# EAGLE design MD2019-hole (EAGLE 9.3.1)

## Sheet 1 of 4: Driver Part
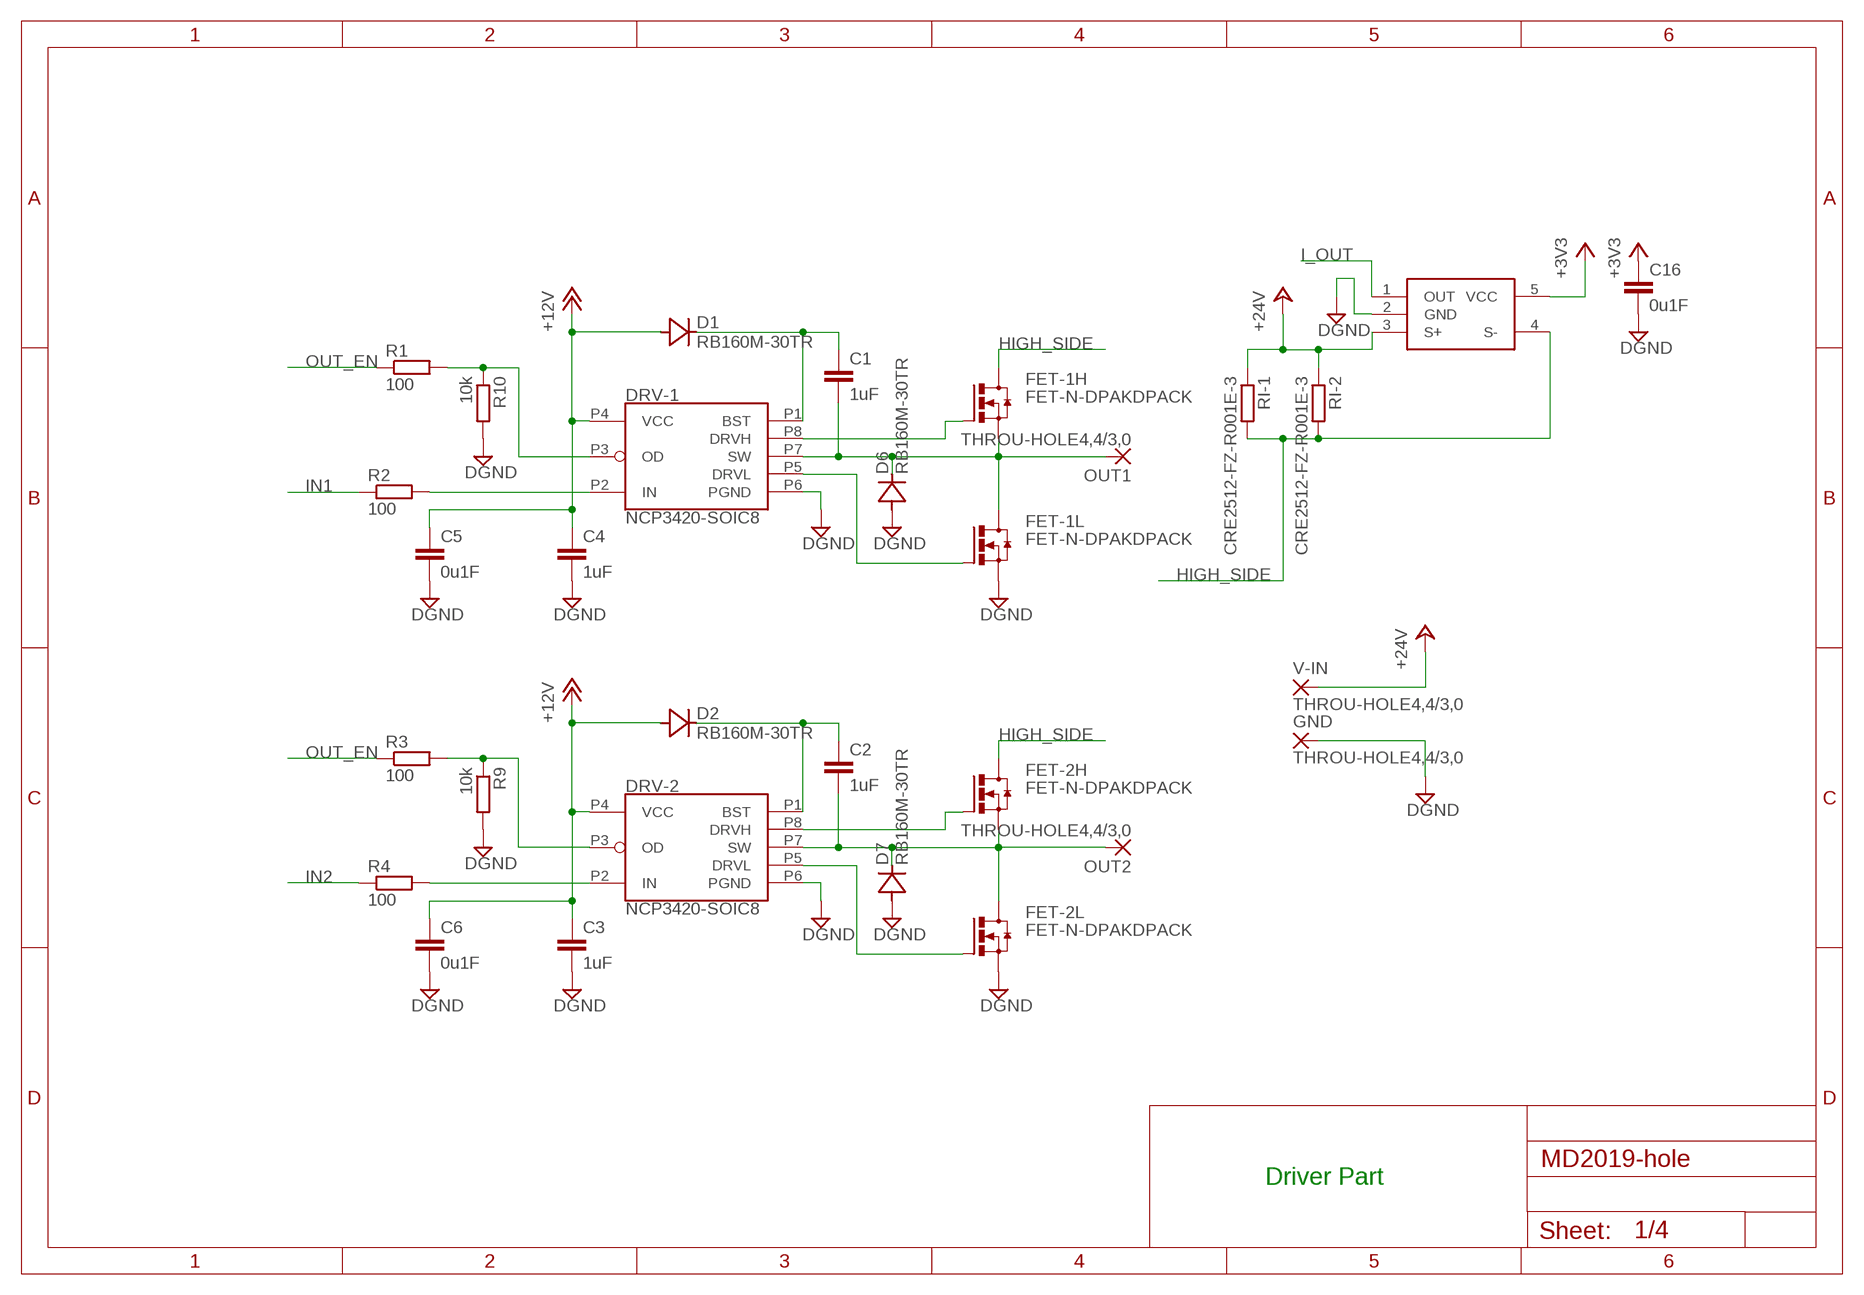
[diagram p0: schematic, sheet 1]

### Parts
C1  1uF  C-EUC0805  [C0805]
C2  1uF  C-EUC0805  [C0805]
C3  1uF  C-EUC0805  [C0805]
C4  1uF  C-EUC0805  [C0805]
C5  0u1F  C-EUC0805  [C0805]
C6  0u1F  C-EUC0805  [C0805]
C16  0u1F  C-EUC0805  [C0805]
D1  RB160M-30TR  DIODE-  [SOD123]
D2  RB160M-30TR  DIODE-  [SOD123]
D6  RB160M-30TR  DIODE-  [SOD123]
D7  RB160M-30TR  DIODE-  [SOD123]
DRV-1  NCP3420-SOIC8  [SOIC-8]
DRV-2  NCP3420-SOIC8  [SOIC-8]
FET-1H  FET-N-DPAKDPACK  [DPACK]
FET-1L  FET-N-DPAKDPACK  [DPACK]
FET-2H  FET-N-DPAKDPACK  [DPACK]
FET-2L  FET-N-DPAKDPACK  [DPACK]
GND  THROU-HOLE4,4/3,0  [4,4/3,0]
I_SEN  ZXCT108  [SOT25]
OUT1  THROU-HOLE4,4/3,0  [4,4/3,0]
OUT2  THROU-HOLE4,4/3,0  [4,4/3,0]
R1  100  R-EU_R0603  [R0603]
R2  100  R-EU_R0603  [R0603]
R3  100  R-EU_R0603  [R0603]
R4  100  R-EU_R0603  [R0603]
R9  10k  R-EU_R0603  [R0603]
R10  10k  R-EU_R0603  [R0603]
RI-1  CRE2512-FZ-R001E-3  [CRE2512-R001]
RI-2  CRE2512-FZ-R001E-3  [CRE2512-R001]
V-IN  THROU-HOLE4,4/3,0  [4,4/3,0]

### Nets
+3V3: C16.1 I_SEN.5(VCC) ; also sheet 2,3,4
+12V: C3.1 C4.1 C5.1 C6.1 D1.A D2.A DRV-1.P4(VCC) DRV-2.P4(VCC) ; also sheet 4
+24V: I_SEN.3(S+) RI-1.P$1 RI-2.P$1 V-IN.1(P) ; also sheet 4
DGND: C3.2 C4.2 C5.2 C6.2 C16.2 D6.A D7.A DRV-1.P6(PGND) DRV-2.P6(PGND) FET-1L.3(S) FET-2L.3(S) GND.1(P) I_SEN.2(GND) R9.2 R10.2 ; also sheet 2,3,4
HIGH_SIDE: FET-1H.4(D) FET-2H.4(D) I_SEN.4(S-) RI-1.P$2 RI-2.P$2
I_OUT: I_SEN.1(OUT) ; also sheet 2
IN1: R2.1 ; also sheet 2
IN2: R4.1 ; also sheet 2
N$1: C1.2 D6.C DRV-1.P7(SW) FET-1H.3(S) FET-1L.4(D) OUT1.1(P)
N$2: C1.1 D1.C DRV-1.P1(BST)
N$3: DRV-1.P8(DRVH) FET-1H.1(G)
N$4: DRV-1.P5(DRVL) FET-1L.1(G)
N$5: C2.2 D7.C DRV-2.P7(SW) FET-2H.3(S) FET-2L.4(D) OUT2.1(P)
N$6: C2.1 D2.C DRV-2.P1(BST)
N$7: DRV-2.P2(IN) R4.2
N$8: DRV-2.P8(DRVH) FET-2H.1(G)
N$9: DRV-2.P5(DRVL) FET-2L.1(G)
N$10: DRV-2.P3(OD) R3.2 R9.1
N$11: DRV-1.P2(IN) R2.2
N$12: DRV-1.P3(OD) R1.2 R10.1
OUT_EN: R1.1 R3.1 ; also sheet 2

### Notes on the sheet
- Driver Part

## Sheet 2 of 4: STM32
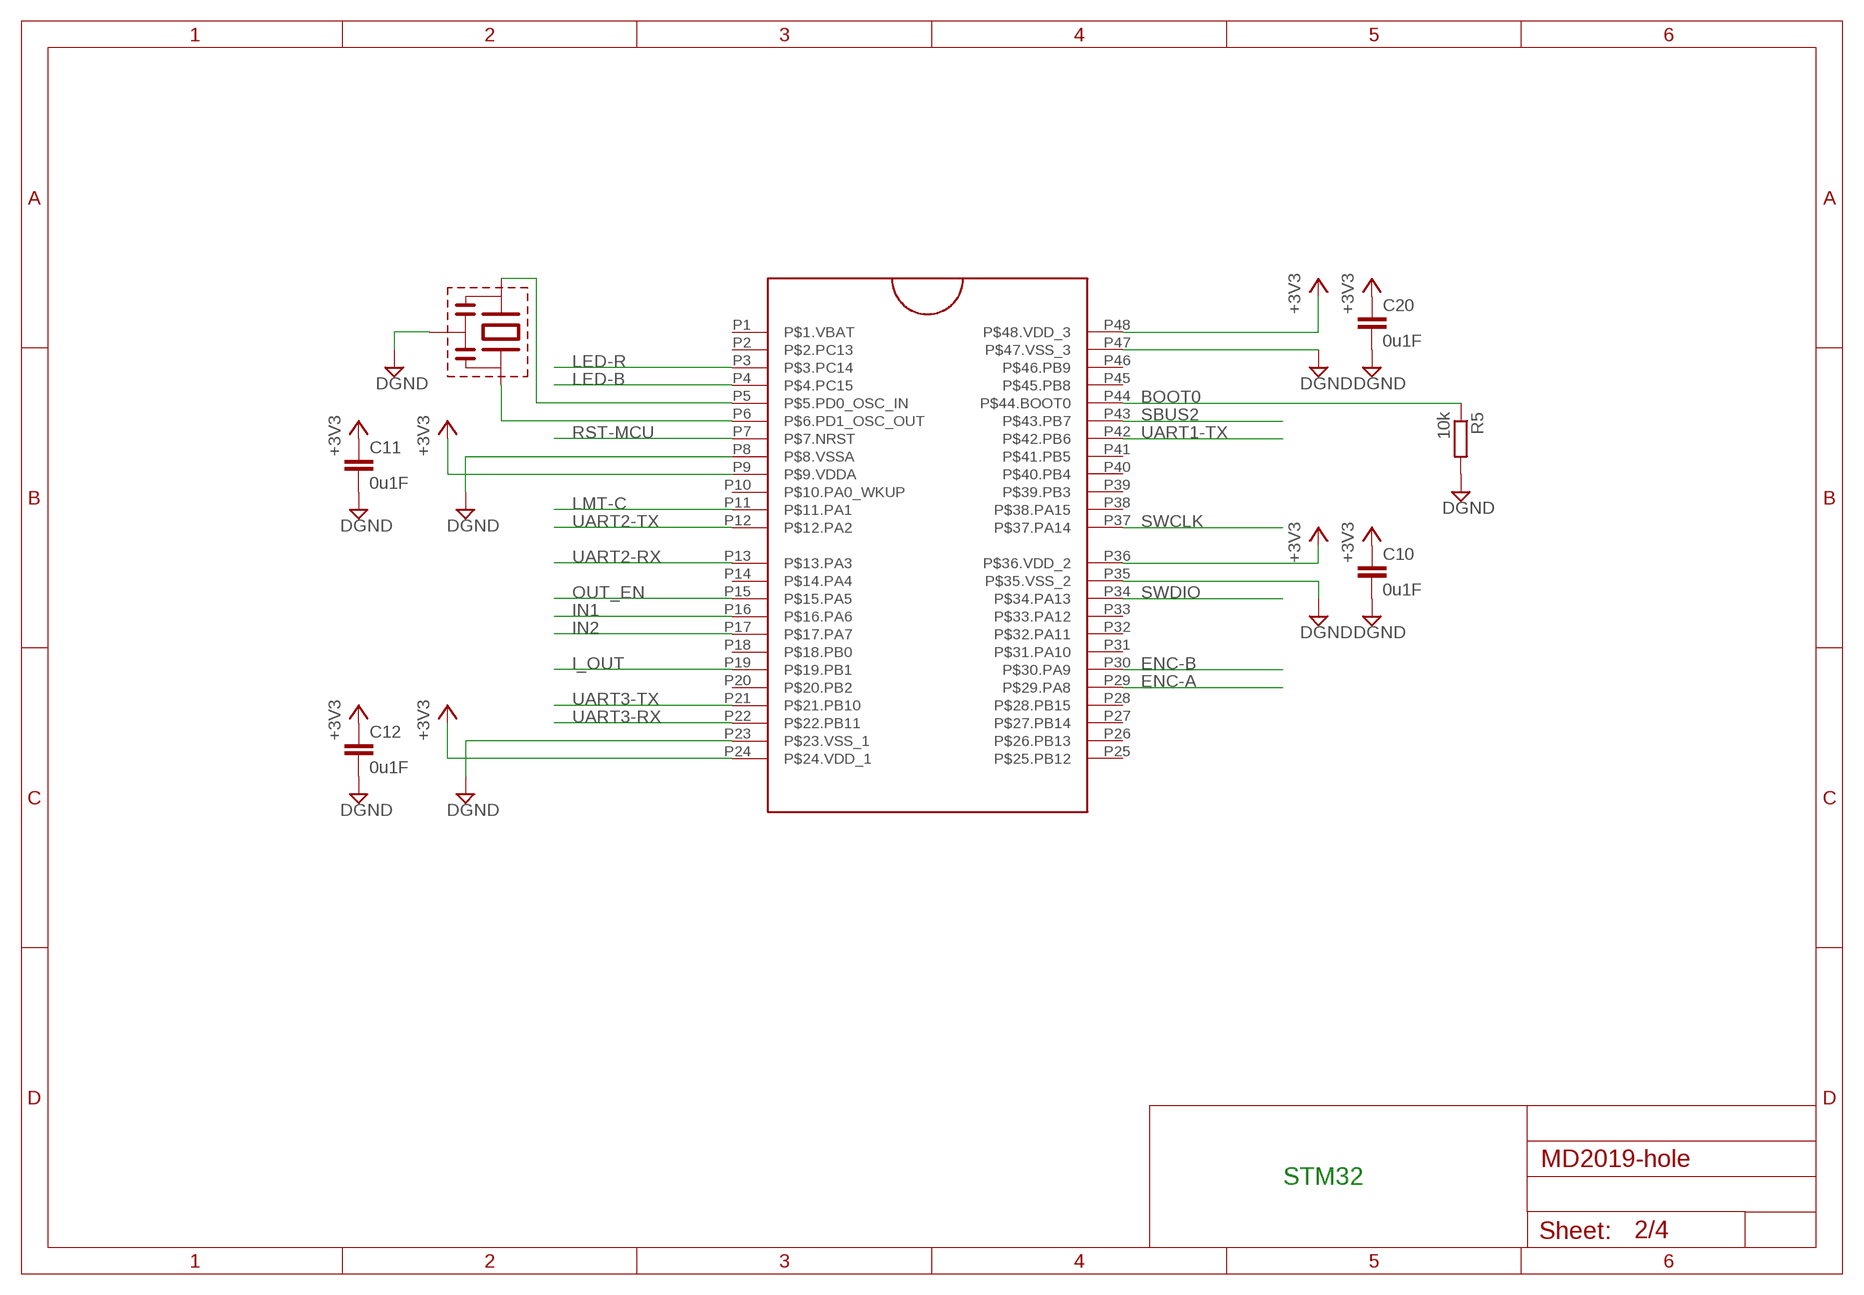
[diagram p1: schematic, sheet 2]

### Parts
C10  0u1F  C-EUC0805  [C0805]
C11  0u1F  C-EUC0805  [C0805]
C12  0u1F  C-EUC0805  [C0805]
C20  0u1F  C-EUC0805  [C0805]
OSC  CERALOCK  [CSTCE]
R5  10k  R-EU_R0603  [R0603]
U$11  STM32F1038  [LQFP48_F103]

### Nets
+3V3: C10.1 C11.1 C12.1 C20.1 U$11.P9(P$9.VDDA) U$11.P24(P$24.VDD_1) U$11.P36(P$36.VDD_2) U$11.P48(P$48.VDD_3) ; also sheet 1,3,4
BOOT0: R5.1 U$11.P44(P$44.BOOT0)
DGND: C10.2 C11.2 C12.2 C20.2 OSC.P$3 R5.2 U$11.P8(P$8.VSSA) U$11.P23(P$23.VSS_1) U$11.P35(P$35.VSS_2) U$11.P47(P$47.VSS_3) ; also sheet 1,3,4
ENC-A: U$11.P29(P$29.PA8) ; also sheet 3
ENC-B: U$11.P30(P$30.PA9) ; also sheet 3
I_OUT: U$11.P19(P$19.PB1) ; also sheet 1
IN1: U$11.P16(P$16.PA6) ; also sheet 1
IN2: U$11.P17(P$17.PA7) ; also sheet 1
LED-B: U$11.P4(P$4.PC15) ; also sheet 3
LED-R: U$11.P3(P$3.PC14) ; also sheet 3
LMT-C: U$11.P11(P$11.PA1) ; also sheet 3
N$19: OSC.P$1 U$11.P5(P$5.PD0_OSC_IN)
N$20: OSC.P$2 U$11.P6(P$6.PD1_OSC_OUT)
OUT_EN: U$11.P15(P$15.PA5) ; also sheet 1
RST-MCU: U$11.P7(P$7.NRST) ; also sheet 3
SBUS2: U$11.P43(P$43.PB7) ; also sheet 3
SWCLK: U$11.P37(P$37.PA14) ; also sheet 3
SWDIO: U$11.P34(P$34.PA13) ; also sheet 3
UART1-TX: U$11.P42(P$42.PB6)
UART2-RX: U$11.P13(P$13.PA3) ; also sheet 3
UART2-TX: U$11.P12(P$12.PA2) ; also sheet 3
UART3-RX: U$11.P22(P$22.PB11) ; also sheet 3
UART3-TX: U$11.P21(P$21.PB10) ; also sheet 3
Unconnected: U$11.P1(P$1.VBAT) U$11.P2(P$2.PC13) U$11.P10(P$10.PA0_WKUP) U$11.P14(P$14.PA4) U$11.P18(P$18.PB0) U$11.P20(P$20.PB2) U$11.P25(P$25.PB12) U$11.P26(P$26.PB13) U$11.P27(P$27.PB14) U$11.P28(P$28.PB15) U$11.P31(P$31.PA10) U$11.P32(P$32.PA11) U$11.P33(P$33.PA12) U$11.P38(P$38.PA15) U$11.P39(P$39.PB3) U$11.P40(P$40.PB4) U$11.P41(P$41.PB5) U$11.P45(P$45.PB8) U$11.P46(P$46.PB9)

### Notes on the sheet
- STM32

## Sheet 3 of 4: Peripherarl / Interface
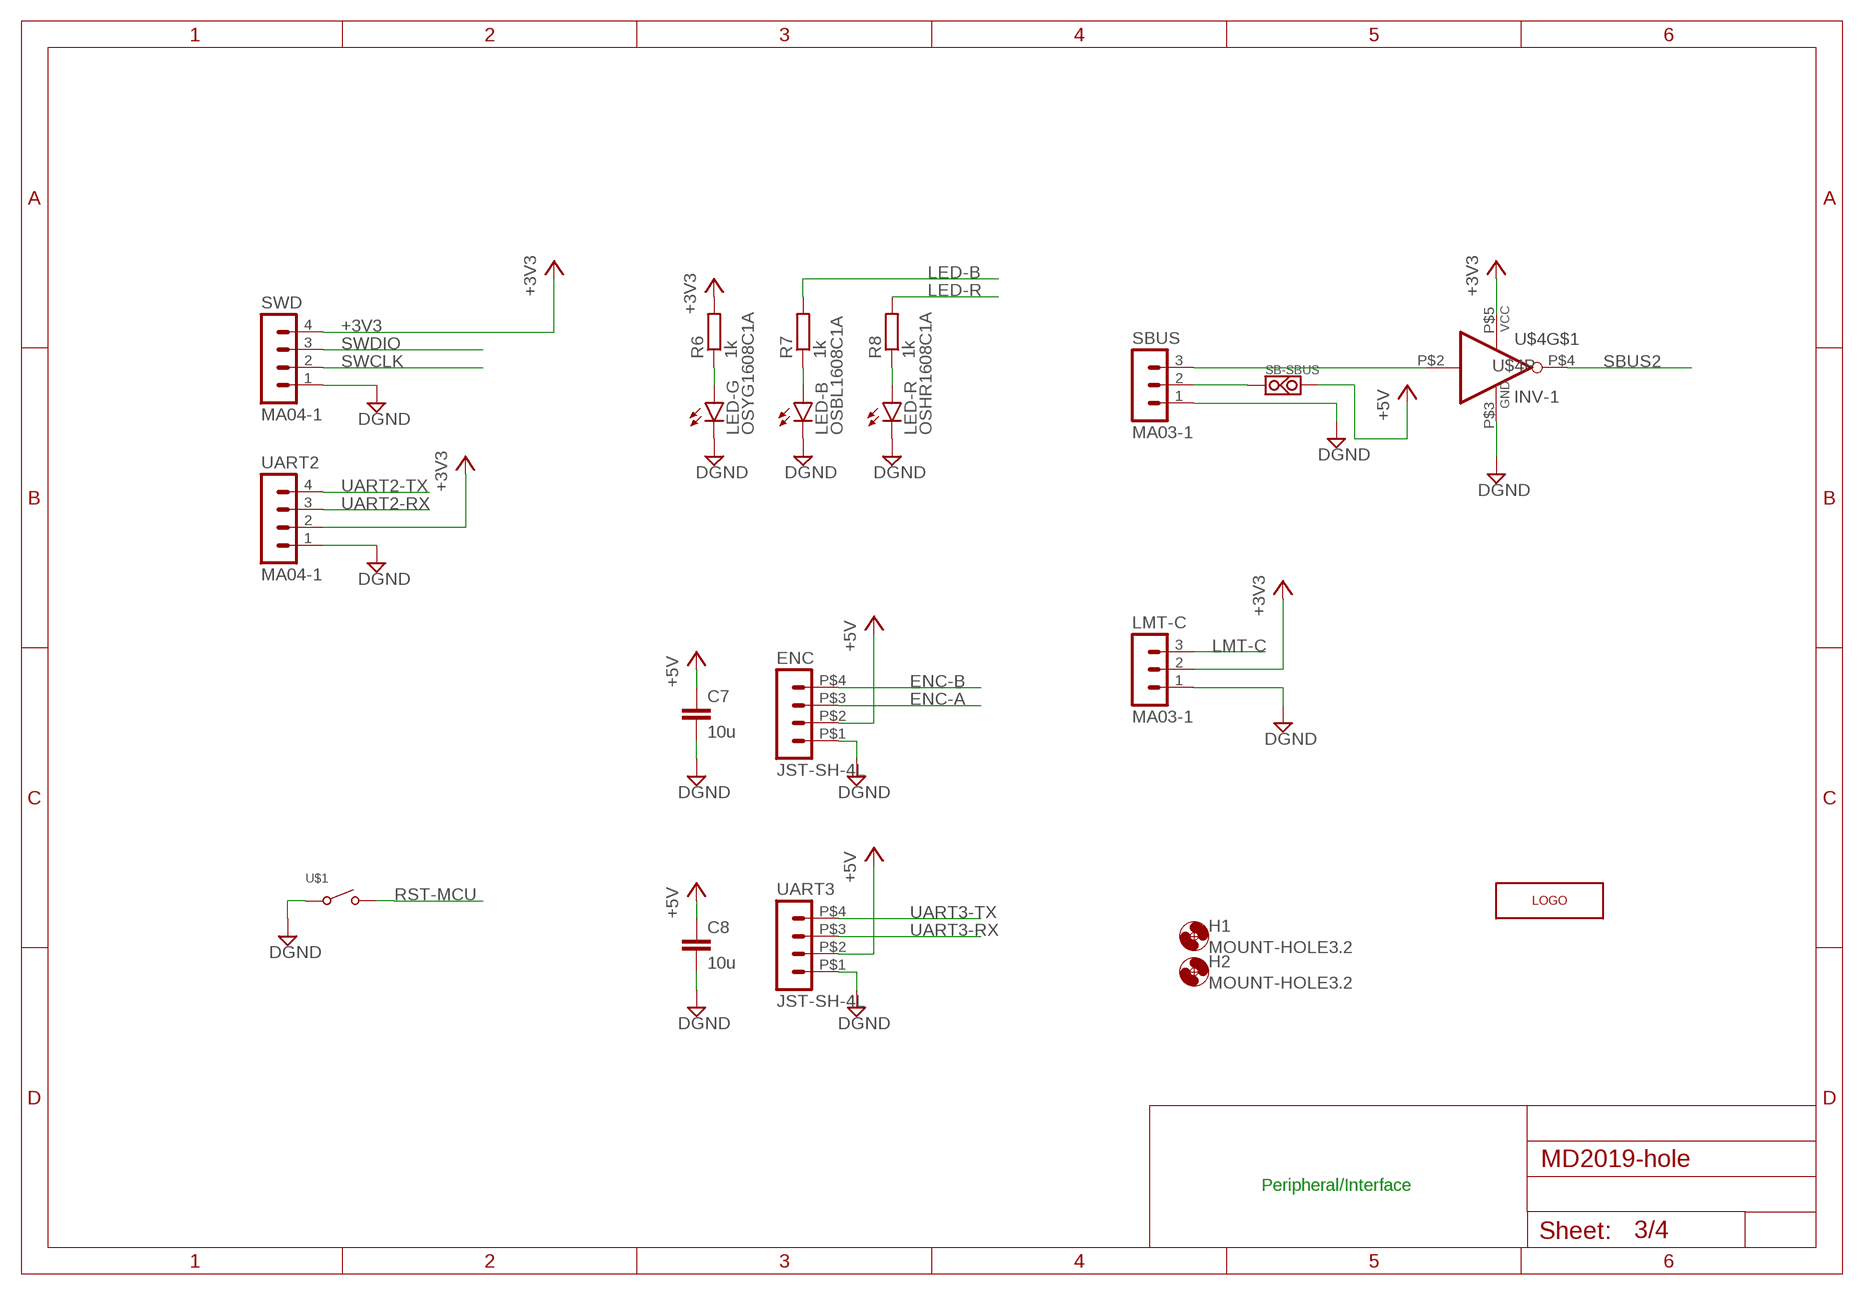
[diagram p2: schematic, sheet 3]

### Parts
C7  10u  C-EUC0805K  [C0805K]
C8  10u  C-EUC0805K  [C0805K]
ENC  JST-SH-4L  [JST-SH-4L]
H1  MOUNT-HOLE3.2  [3,2]
H2  MOUNT-HOLE3.2  [3,2]
LED-B  OSBL1608C1A  LEDCHIPLED_0603  [CHIPLED_0603]
LED-G  OSYG1608C1A  LEDCHIPLED_0603  [CHIPLED_0603]
LED-R  OSHR1608C1A  LEDCHIPLED_0603  [CHIPLED_0603]
LMT-C  MA03-1  [MA03-1]
R6  1k  R-EU_R0603  [R0603]
R7  1k  R-EU_R0603  [R0603]
R8  1k  R-EU_R0603  [R0603]
SB-SBUS  SHORT-PINLAND  [SHORT-LAND]
SBUS  MA03-1  [MA03-1]
SWD  MA04-1  [MA04-1]
U$1  TACTILE-SMALL  [TACTILE-SMALL]
U$3  LOGOKUTEI2  [LOGO_KUTEI2]
U$4  INV-1  [CMPAK-5]
UART2  MA04-1  [MA04-1]
UART3  JST-SH-4L  [JST-SH-4L]

### Nets
+3V3: LMT-C.2 R6.2 SWD.4 U$4.P$5(P:VCC) UART2.2 ; also sheet 1,2,4
+5V: C7.1 C8.1 ENC.P$2 SB-SBUS.FROM UART3.P$2 ; also sheet 4
DGND: C7.2 C8.2 ENC.P$1 LED-B.C LED-G.C LED-R.C LMT-C.1 SBUS.1 SWD.1 U$1.P$1 U$4.P$3(P:GND) UART2.1 UART3.P$1 ; also sheet 1,2,4
ENC-A: ENC.P$3 ; also sheet 2
ENC-B: ENC.P$4 ; also sheet 2
LED-B: R7.2 ; also sheet 2
LED-R: R8.2 ; also sheet 2
LMT-C: LMT-C.3 ; also sheet 2
N$14: SBUS.3 U$4.P$2(I)
N$15: SB-SBUS.TO SBUS.2
N$17: LED-R.A R8.1
N$23: LED-G.A R6.1
N$24: LED-B.A R7.1
RST-MCU: U$1.P$2 ; also sheet 2
SBUS2: U$4.P$4(O) ; also sheet 2
SWCLK: SWD.2 ; also sheet 2
SWDIO: SWD.3 ; also sheet 2
UART2-RX: UART2.3 ; also sheet 2
UART2-TX: UART2.4 ; also sheet 2
UART3-RX: UART3.P$3 ; also sheet 2
UART3-TX: UART3.P$4 ; also sheet 2

### Notes on the sheet
- Peripheral/Interface

## Sheet 4 of 4: Power Supplay
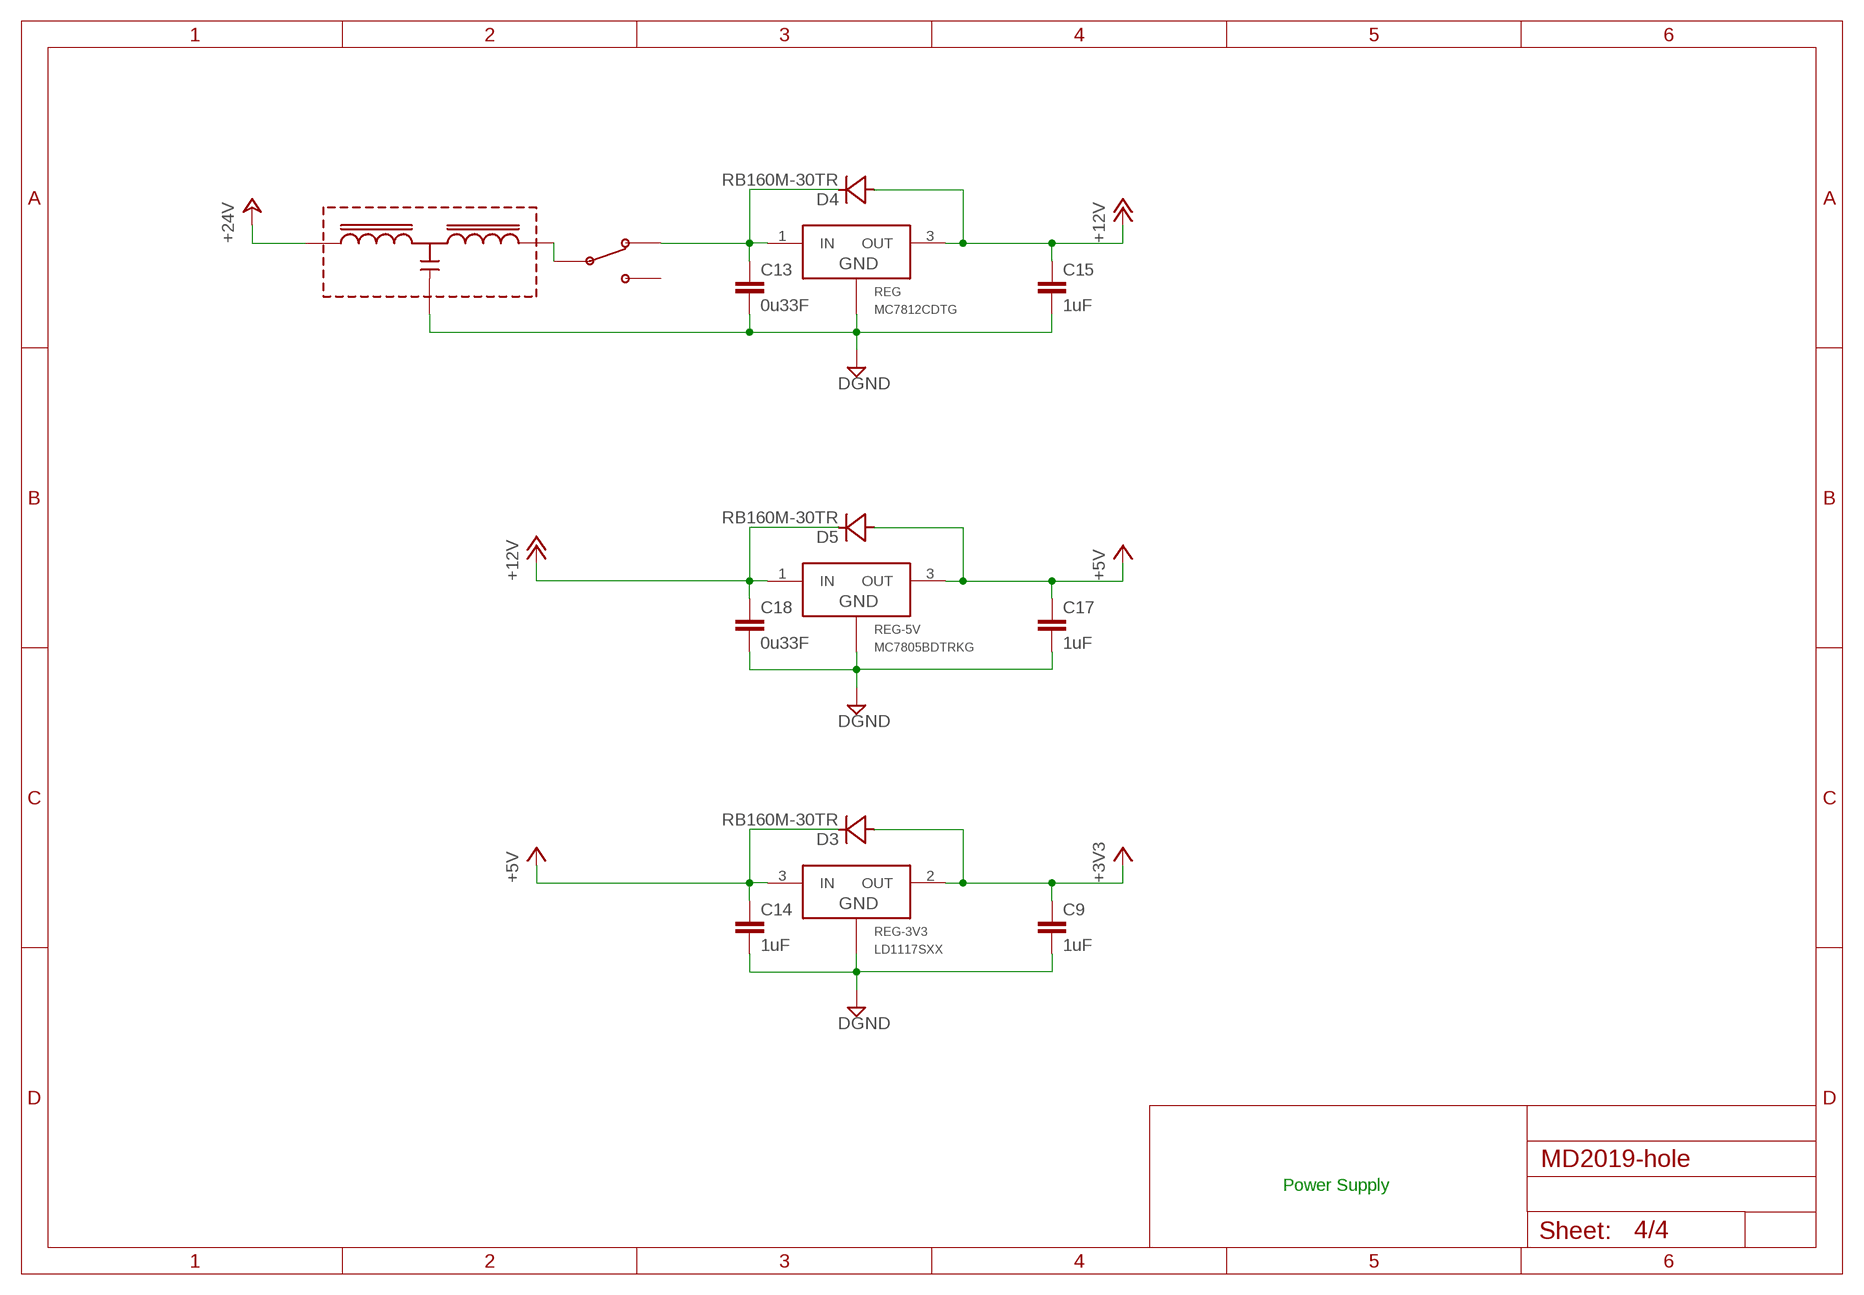
[diagram p3: schematic, sheet 4]

### Parts
C9  1uF  C-EUC0805  [C0805]
C13  0u33F  C-EUC0805  [C0805]
C14  1uF  C-EUC0805  [C0805]
C15  1uF  C-EUC0805  [C0805]
C17  1uF  C-EUC0805  [C0805]
C18  0u33F  C-EUC0805  [C0805]
D3  RB160M-30TR  DIODE-  [SOD123]
D4  RB160M-30TR  DIODE-  [SOD123]
D5  RB160M-30TR  DIODE-  [SOD123]
FLT1  EMI-ACHXX4518-L  [ACH4518-L]
PWR-SW  SW-SPDT  [SSSS213202]
REG  MC7812CDTG  78XXDPACK  [DPACK]
REG-3V3  LD1117SXX  [SOT223]
REG-5V  MC7805BDTRKG  78XXDPACK  [DPACK]

### Nets
+3V3: C9.1 D3.A REG-3V3.2(OUT) ; also sheet 1,2,3
+5V: C14.1 C17.1 D3.C D5.A REG-3V3.3(IN) REG-5V.3(OUT) ; also sheet 3
+12V: C15.1 C18.1 D4.A D5.C REG-5V.1(IN) REG.3(OUT) ; also sheet 1
+24V: FLT1.P$1 ; also sheet 1
DGND: C9.2 C13.2 C14.2 C15.2 C17.2 C18.2 FLT1.P$2 REG-3V3.1(GND) REG-3V3.4(GND) REG-5V.4(GND) REG.4(GND) ; also sheet 1,2,3
N$13: FLT1.P$3 PWR-SW.P$2 PWR-SW.P$5
N$18: C13.1 D4.C PWR-SW.P$3 PWR-SW.P$6 REG.1(IN)
Unconnected: PWR-SW.P$1 PWR-SW.P$4

### Notes on the sheet
- Power Supply

## Library data of the parts
C1-C18 C20 = rcl:C-EU: CAPACITOR, European symbol; SPICEPREFIX: C
D1-D7 = My-Library:DIODE-
DRV-1 DRV-2 = My-Library:NCP3420-SOIC8
ENC UART3 = My-con:JST-SH-4L
FET-1H FET-1L FET-2H FET-2L = My-Library:FET-N-DPAK
FLT1 = My-Library:EMI-ACHXX
GND OUT1 OUT2 V-IN = My-Library:THROU-HOLE
H1 H2 = holes:MOUNT-HOLE: MOUNTING HOLE with drill center marker
I_SEN = My-Library:ZXCT108*
LED-B LED-G LED-R = led:LED: LED OSRAM: - CHIPLED LG R971, LG N971, LY N971, LG Q971, LY Q971, LO R971, LY R971 LH N974, LH R974 LS Q976, LO Q976, LY Q976 LO Q996 - Hyper CHIPLED LW Q18S LB Q993, LB Q99A, LB R99A - SideLED LS A670, LO A670, LY A670, LG A670, LP A670 LB A673, LV A673, LT A673, LW A673 LH A674 LY A675 LS A676, LA A676, LO A676, LY A676, LW A676 LS A679, LY A679, LG A679 - Hyper Micro SIDELED® LS Y876, LA Y876, LO Y876, LY Y876 LT Y87S - SmartLED LW L88C, LW L88S LB L89C, LB L89S, LG L890 LS L89K, LO L89K, LY L89K LS L896, LA L896, LO L896, LY L896 - TOPLED LS T670, LO T670, LY T670, LG T670, LP T670 LSG T670, LSP T670, LSY T670, LOP T670, LYG T670 LG T671, LOG T671, LSG T671 LB T673, LV T673, LT T673, LW T673 LH T674 LS T676, LA T676, LO T676, LY T676, LB T676, LH T676, LSB T676, LW T676 LB T67C, LV T67C, LT T67C, LS T67K, LO T67K, LY T67K, LW E67C LS E67B, LA E67B, LO E67B, LY E67B, LB E67C, LV E67C, LT E67C LW T67C LS T679, LY T679, LG T679 LS T770, LO T770, LY T770, LG T770, LP T770 LB T773, LV T773, LT T773, LW T773 LH T774 LS E675, LA E675, LY E675, LS T675 LS T776, LA T776, LO T776, LY T776, LB T776 LHGB T686 LT T68C, LB T68C - Hyper Mini TOPLED® LB M676 - Mini TOPLED Santana® LG M470 LS M47K, LO M47K, LY M47K Source: http://www.osram.convergy.de LUXEON: - LUMILED® LXK2-PW12-R00, LXK2-PW12-S00, LXK2-PW14-U00, LXK2-PW14-V00 LXK2-PM12-R00, LXK2-PM12-S00, LXK2-PM14-U00 LXK2-PE12-Q00, LXK2-PE12-R00, LXK2-PE12-S00, LXK2-PE14-T00, LXK2-PE14-U00 LXK2-PB12-K00, LXK2-PB12-L00, LXK2-PB12-M00, LXK2-PB14-N00, LXK2-PB14-P00, LXK2-PB14-Q00 LXK2-PR12-L00, LXK2-PR12-M00, LXK2-PR14-Q00, LXK2-PR14-R00 LXK2-PD12-Q00, LXK2-PD12-R00, LXK2-PD12-S00 LXK2-PH12-R00, LXK2-PH12-S00 LXK2-PL12-P00, LXK2-PL12-Q00, LXK2-PL12-R00 Source: www.luxeon.com KINGBRIGHT: KA-3528ASYC Source: www.kingbright.com
LMT-C SBUS = My-Library:MA03-1
OSC = My-Library:CERALOCK
PWR-SW = My-Library:SW-SPDT
R1-R4 R9 R10 = rcl:R-EU_: RESISTOR, European symbol; SPICEPREFIX: R
R5-R8 = rcl:R-EU_: RESISTOR, European symbol
REG REG-5V = My-Library:78XX
REG-3V3 = My-Library:LD1117SXX
RI-1 RI-2 = My-Library:CRE2512-FZ-R001E-3
SB-SBUS = My-Library:SHORT-PIN
SWD UART2 = My-Library:MA04-1
U$1 = My-Library:TACTILE-SMALL
U$3 = My-Library:LOGO
U$4 = My-Library:INV-1
U$11 = My-Library:STM32F103*8

## Board
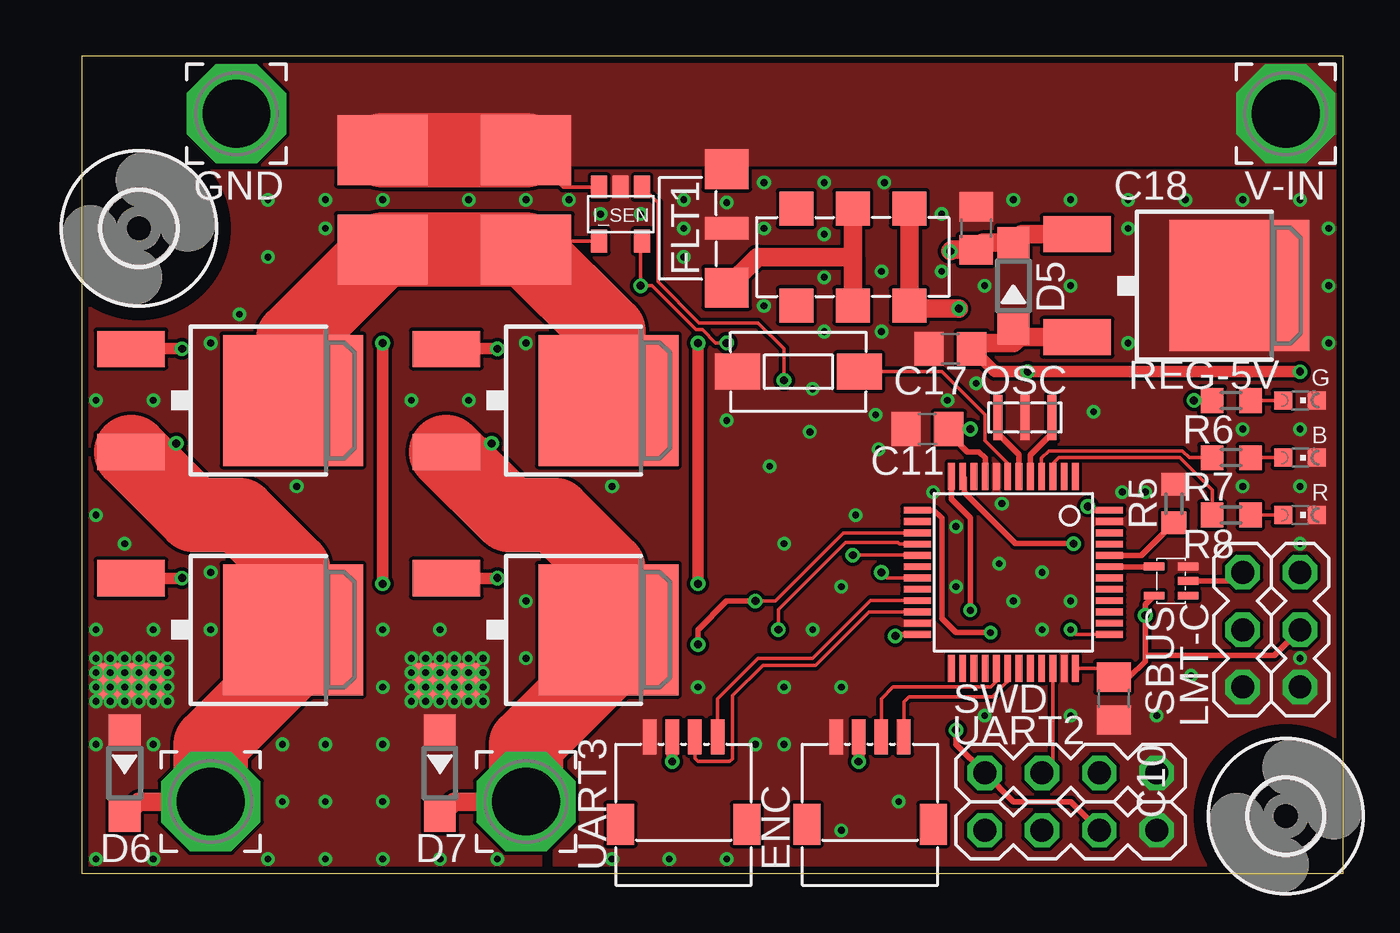
[diagram p4: board, top side]
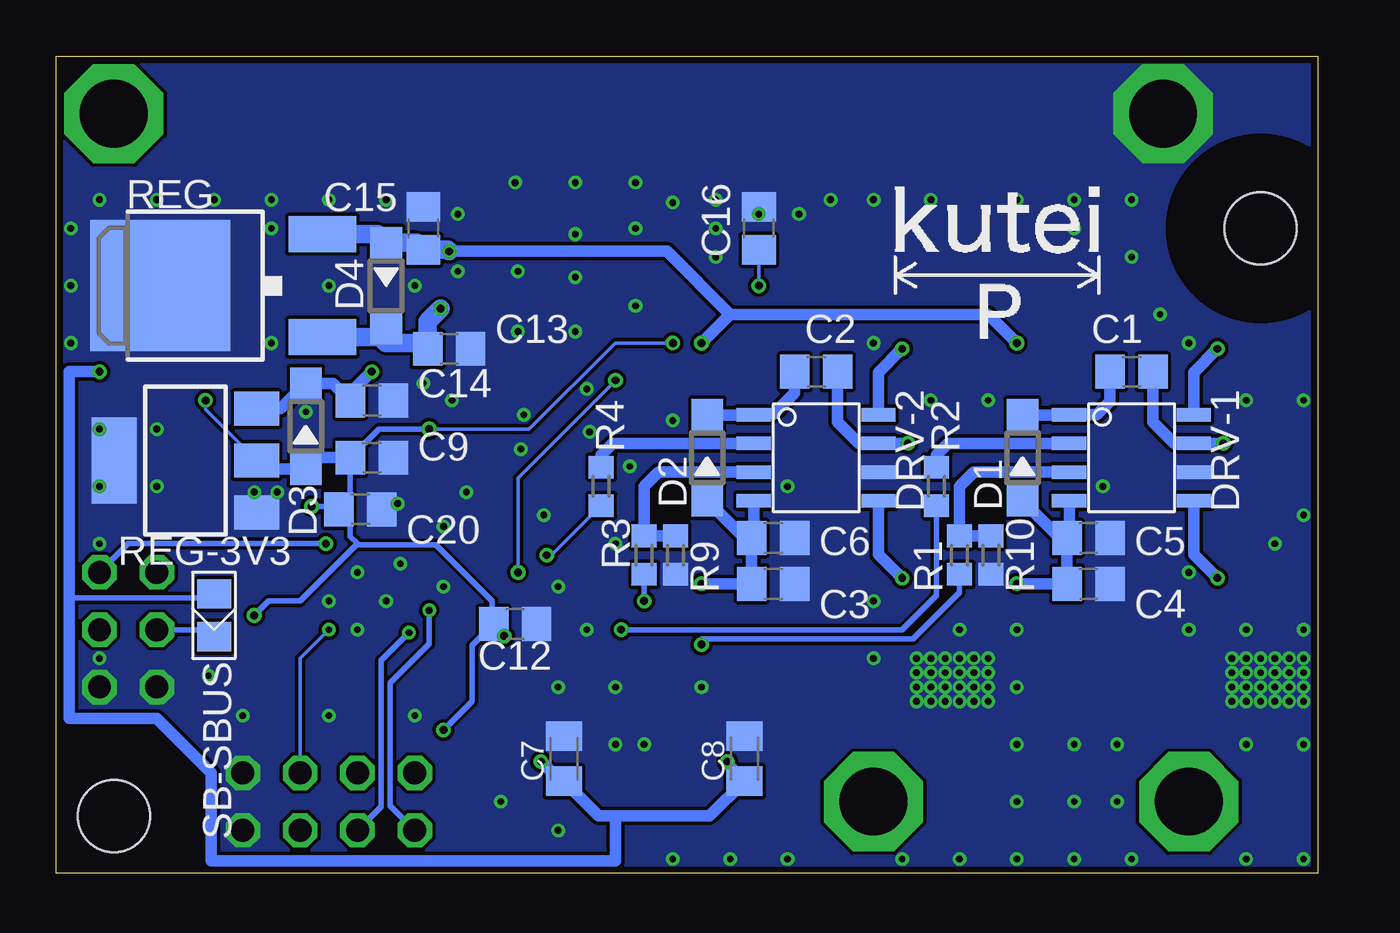
[diagram p5: board, bottom side, seen from below]

Size 55.88 x 36.2 mm. Coordinates in mm from the lower left corner, seen from the top.
Outline: 0,0 55.88,0 55.88,36.2 0,36.2 0,0
Copper layers (1*16): Top 0.035mm / dielectric 1.5mm / Bottom 0.035mm
Design rules "SeeedStudio_2layer_DRU_no_angle_20180719": minimum track width 6mil, minimum drill 0.3mm, track to track 6mil, track to pad 6mil, pad to pad 6mil, via to via 6mil, smd to smd 0mil, copper to edge 0.3mm, drill to drill 12mil, minimum pad ring 0.15mm, minimum via ring 0.15mm, stop-mask expansion 2mil, vias tented up to drill 100mil, thermal gap 0.2mm

### Footprints (pad centres in the part's own frame; a part is rotated, then mirrored left to right if it is on the bottom)
C0805 = smd 1.3 x 1.5: 1 -0.95,0; 2 0.95,0
C0805K = smd 1.3 x 1.6: 1 -1,0; 2 1,0
SOD123 = smd 1.4 x 1.4: A 1.9,0; C -1.9,0
SOIC-8 = smd 0.6 x 1.52: P1 1.905,2.76; P2 0.635,2.76; P3 -0.635,2.76; P4 -1.905,2.76; P5 -1.905,-2.76; P6 -0.635,-2.76; P7 0.635,-2.76; P8 1.905,-2.76
JST-SH-4L = smd 0.6 x 1.55: P$1 -1.5,3; P$2 -0.5,3; P$3 0.5,3; P$4 1.5,3 | smd 1.2 x 1.8: P$5 -2.8,-0.875; P$6 2.8,-0.875
DPACK = smd 1.6 x 3: 1 -2.28,-4.8; 3 2.28,-4.8 | smd 5.8 x 6.2: 4 0,2.38
ACH4518-L = smd 1.75 x 1.94: P$1 -2.625,0; P$3 2.625,0 | smd 1 x 1.94: P$2 0,0
4,4/3,0 = drill 3 pad 4.4 octagon: 1 0,0
3,2 = hole 3.2: 0,0
SOT25 = smd 0.7 x 1: 1 -0.95,-1.2; 2 0,-1.2; 3 0.95,-1.2; 4 0.95,1.2; 5 -0.95,1.2
CHIPLED_0603 = smd 0.8 x 0.8: A 0,-0.75; C 0,0.75
MA03-1 = drill 1.016 octagon: 1 -2.54,0; 2 0,0; 3 2.54,0
CSTCE = smd 0.4 x 2: P$1 -1.2,0; P$2 1.2,0; P$3 0,0
SSSS213202 = smd 1.5 x 1.5: P$1 -2.5,-2.15; P$2 0,-2.15; P$3 2.5,-2.15; P$4 -2.5,2.15; P$5 0,2.15; P$6 2.5,2.15
R0603 = smd 1 x 1.1: 1 -0.85,0; 2 0.85,0
SOT223 = smd 1.5 x 2: 1 -2.3,-3.15; 2 0,-3.15; 3 2.3,-3.15 | smd 3.8 x 2: 4 0,3.15
CRE2512-R001 = smd 3.1 x 4: P$1 -2.2,0; P$2 2.2,0
SHORT-LAND = smd 1.3 x 1.5: FROM 0.95,0; TO -0.95,0
MA04-1 = drill 1.016 octagon: 1 -3.81,0; 2 -1.27,0; 3 1.27,0; 4 3.81,0
TACTILE-SMALL = smd 2 x 1.6: P$1 -2.7,0; P$2 2.7,0
CMPAK-5 = smd 0.35 x 0.9: P$1 -0.65,-0.75; P$2 0,-0.75; P$3 0.65,-0.75; P$4 0.65,0.75; P$5 -0.65,0.75
LQFP48_F103 = smd 0.3 x 1.2: P1 -2.75,-4.25; P2 -2.25,-4.25; P3 -1.75,-4.25; P4 -1.25,-4.25; P5 -0.75,-4.25; P6 -0.25,-4.25; P7 0.25,-4.25; P8 0.75,-4.25; P9 1.25,-4.25; P10 1.75,-4.25; P11 2.25,-4.25; P12 2.75,-4.25; P25 2.75,4.25; P26 2.25,4.25; P27 1.75,4.25; P28 1.25,4.25; P29 0.75,4.25; P30 0.25,4.25; P31 -0.25,4.25; P32 -0.75,4.25; P33 -1.25,4.25; P34 -1.75,4.25; P35 -2.25,4.25; P36 -2.75,4.25 | smd 1.2 x 0.3: P13 4.25,-2.75; P14 4.25,-2.25; P15 4.25,-1.75; P16 4.25,-1.25; P17 4.25,-0.75; P18 4.25,-0.25; P19 4.25,0.25; P20 4.25,0.75; P21 4.25,1.25; P22 4.25,1.75; P23 4.25,2.25; P24 4.25,2.75; P37 -4.25,2.75; P38 -4.25,2.25; P39 -4.25,1.75; P40 -4.25,1.25; P41 -4.25,0.75; P42 -4.25,0.25; P43 -4.25,-0.25; P44 -4.25,-0.75; P45 -4.25,-1.25; P46 -4.25,-1.75; P47 -4.25,-2.25; P48 -4.25,-2.75

### Placement (x,y rotation side)
C1  8.26,22.22 0 bottom
C2  22.22,22.22 0 bottom
C3  24.13,12.83 0 bottom
C4  10.16,12.83 0 bottom
C5  10.16,14.86 0 bottom
C6  24.13,14.86 0 bottom
C7  33.4,5.08 90 bottom
C8  25.4,5.08 90 bottom
C9  41.91,18.41 0 bottom
C10  45.72,7.75 270 top
C11  37.47,19.68 180 top
C12  35.56,11.05 0 bottom
C13  38.48,23.24 0 bottom
C14  41.91,20.95 0 bottom
C15  39.62,28.57 90 bottom
C16  24.76,28.57 90 bottom
C17  38.48,23.24 180 top
C18  39.62,28.57 90 top
C20  42.42,16.13 0 bottom
D1  13.08,18.41 270 bottom
D2  27.05,18.41 270 bottom
D3  44.83,19.81 270 bottom
D4  41.27,26.04 90 bottom
D5  41.27,26.04 270 top
D6  1.91,4.45 90 top
D7  15.88,4.45 90 top
DRV-1  8.26,18.41 90 bottom
DRV-2  22.22,18.41 90 bottom
ENC  34.93,3.05 0 top
FET-1H  6.99,20.95 270 top
FET-1L  6.99,10.79 270 top
FET-2H  20.95,20.95 270 top
FET-2L  20.95,10.79 270 top
FLT1  28.57,28.57 270 top
GND  6.86,33.66 0 top
H1  53.34,2.54 0 top
H2  2.54,28.57 0 top
I_SEN  23.88,29.21 180 top
LED-B  53.98,18.41 270 top
LED-G  53.98,20.95 270 top
LED-R  53.98,15.88 270 top
LMT-C  53.98,10.79 90 top
OSC  41.78,20.19 180 top
OUT1  5.71,3.17 0 top
OUT2  19.68,3.17 0 top
PWR-SW  34.16,27.3 0 top
R1  15.88,14.1 90 bottom
R2  16.89,17.14 90 bottom
R3  29.84,14.1 90 bottom
R4  31.75,17.14 90 bottom
R5  48.39,16.38 90 top
R6  50.93,20.95 180 top
R7  50.93,18.41 180 top
R8  50.93,15.88 180 top
R9  28.45,14.1 270 bottom
R10  14.48,14.1 270 bottom
REG  48.9,26.04 90 bottom
REG-3V3  50.16,18.29 90 bottom
REG-5V  48.9,26.04 270 top
RI-1  19.68,29.84 270 top
RI-2  13.34,29.84 270 top
SB-SBUS  48.9,11.43 90 bottom
SBUS  51.44,10.79 90 top
SWD  43.82,4.45 180 top
U$1  31.75,22.22 0 top
U$3  19.18,22.22 0 bottom
U$4  48.26,12.95 90 top
U$11  41.27,13.34 180 top
UART2  43.82,1.91 180 top
UART3  26.67,3.05 0 top
V-IN  53.34,33.66 0 top

### Tracks (layer width: path | path; a pad name or v marks a point on that pad's centre or on a via)
+3V3  (via drill 0.35)
  Top 0.152: v49.28,20.95 R6.2 | C10.1 45.33,9.09 U$11.P36 | v28.57,23.5 28.08,23.5 27.5,24.08 27.22,24.08 25.27,26.04 v24.76,26.04 24.76,27.95 I_SEN.5
  Top 0.254: v39.37,19.68 C11.1 38.41,19.5 39.24,18.67 39.75,18.67 40.02,18.39 U$11.P9 | v36.04,10.52 36.11,10.59 U$11.P24 | v44.58,16.26 44.75,16.08 U$11.P48 | U$4.P$5 47.12,11.91 v47.12,11.43 47.12,9.65 | LMT-C.2 52.83,9.65 47.12,9.65 | v38.73,6.35 38.73,5.71 SWD.4 41.27,3.17 43.82,3.17 UART2.2 | 47.12,9.65 47.12,9.4 46.42,8.7 C10.1
  Bottom 0.152: REG-3V3.2 49.28,20.55 v49.28,20.95 | v39.37,19.68 34.93,19.68 31.11,23.5 v28.57,23.5 | v24.76,26.04 C16.1
  Bottom 0.254: v39.37,19.68 41.59,19.68 C9.1 42.86,16.19 | 42.86,16.19 42.86,14.92 42.55,14.61 | 42.86,16.19 42.92,16.13 C20.1 43.52,16.26 v44.58,16.26 | 42.55,14.61 42.48,14.54 39.05,14.54 36.58,12.06 36.58,11.05 C12.1 | C12.1 36.3,10.77 v36.04,10.52 | 42.55,14.61 45.09,12.06 46.48,12.06 v47.12,11.43 | C12.1 37.47,10.09 37.47,7.62 v38.73,6.35
  Bottom 0.508: REG-3V3.2 46.64,17.91 D3.A 44.33,18.41 C9.1
+5V  (via drill 0.35)
  Top 0.508: C17.1 40.45,22.22 v41.91,22.22 v53.98,22.22 | v34.42,4.95 v34.43,4.96 ENC.P$2 | v26.16,4.95 UART3.P$2
  Top 0.813: C17.1 39.69,23.49 41.27,23.49 | 41.27,23.49 D5.A | REG-5V.3 41.54,23.75 41.27,23.49
  Bottom 0.254: SB-SBUS.FROM 49.08,12.19 55.32,12.19
  Bottom 0.508: v41.91,22.22 42.86,21.27 C14.1 43.62,21.71 D3.C 45.96,20.59 REG-3V3.3 | v53.98,22.22 55.32,22.22 55.32,12.19 55.32,6.86 51.43,6.86 49.02,4.45 49.02,0.56 31.11,0.56 31.11,2.54 | 31.11,2.54 31.86,2.54 C7.1 33.54,4.08 v34.42,4.95 | 31.11,2.54 26.94,2.54 C8.1 26.16,4.84 v26.16,4.95
+12V  (via drill 0.35)
  Top 0.508: v13.34,12.83 v13.34,23.49 | v27.3,12.83 v27.3,23.49
  Top 0.813: REG-5V.1 41.66,28.31 D5.C 39.93,27.93 C18.1 38.55,27.62 v38.48,27.56
  Bottom 0.508: C5.1 C4.1 v13.34,12.83 | C5.1 11.02,14.95 DRV-1.P4 | C5.1 11.43,14.86 D1.A | v13.34,23.49 14.61,24.76 26.04,24.76 | DRV-2.P4 24.98,14.95 C6.1 | C6.1 25.39,14.86 D2.A | C6.1 C3.1 v27.3,12.83 | v27.3,23.49 26.04,24.76 | 26.04,24.76 28.83,27.56 v38.48,27.56
  Bottom 0.813: REG-5V.1 41.66,28.31 D5.C 39.93,27.93 C18.1 38.55,27.62 v38.48,27.56
+24V
  Top 0.152: I_SEN.3 21.32,30.41 RI-1.P$1
  Top 3.302: RI-2.P$1 RI-1.P$1
  pour Top (rank 4, no thermals): -0.64,36.2 -0.64,31.11 59.05,31.11 59.05,36.2
BOOT0
  Top 0.254: R5.1 46.94,14.09 U$11.P44
DGND  (via drill 0.3)
  other vias: 14.61,9.53 15.24,9.53 15.88,9.53 16.51,9.53 17.14,9.53 17.78,9.53 14.61,8.89 15.24,8.89 15.88,8.89 16.51,8.89 17.14,8.89 17.78,8.89 14.61,8.26 14.61,7.62 15.24,8.26 15.88,8.26 16.51,8.26 17.14,8.26 17.78,8.26 15.24,7.62 15.88,7.62 16.51,7.62 17.14,7.62 17.78,7.62 0.64,9.53 1.27,9.53 1.91,9.53 2.54,9.53 3.17,9.53 3.81,9.53 0.64,8.89 0.64,8.26 0.64,7.62 1.27,8.89 1.91,8.89 2.54,8.89 3.17,8.89 3.81,8.89 3.81,8.26 3.17,8.26 2.54,8.26 1.91,8.26 1.27,8.26 1.27,7.62 1.91,7.62 2.54,7.62 3.17,7.62 3.81,7.62 0.64,0.64 3.17,0.64 8.26,0.64 10.79,0.64 13.34,0.64 10.79,3.17 13.34,3.17 13.34,5.71 10.79,5.71 13.34,8.26 3.17,5.71 0.64,5.71 0.64,10.79 3.17,10.79 5.71,10.79 5.71,13.34 13.34,10.79 15.88,10.79 15.88,0.64 18.41,0.64 23.49,0.64 26.04,0.64 28.57,0.64 33.66,1.91 36.2,3.17 31.11,5.71 31.11,8.26 33.66,8.26 43.82,6.99 40.01,6.99 29.84,5.71 32.39,10.79 33.66,12.7 43.82,12.06 41.27,12.06 42.55,10.79 42.55,13.34 40.64,13.72 40.77,16.38 44.83,20.45 39.62,21.72 46.36,28.57 46.36,26.04 46.36,23.49 43.82,26.04 48.9,29.84 51.44,29.84 53.98,29.84 55.25,28.57 55.25,26.04 55.25,23.49 53.98,19.68 53.98,17.14 53.98,14.61 51.44,17.14 51.44,19.68 47.62,6.99 53.98,9.53 49.15,8.76 47.12,16.89 46.1,16.89 40.01,26.04 38.1,26.67 38.1,29.21 41.27,29.84 43.82,29.84 46.36,29.84 35.56,30.61 32.89,30.61 30.23,30.61 30.23,28.57 26.67,28.57 26.67,29.84 26.67,27.3 28.57,29.72 24.76,29.21 22.99,29.21 21.59,29.84 19.68,29.84 17.14,29.84 13.34,29.84 10.79,29.84 34.29,15.88 32.26,19.56 37.72,16.89 35.31,18.8 38.73,12.7 38.73,15.37 30.48,18.03 28.57,20.07 32.89,24 35.43,24 35.43,26.67 32.89,26.42 32.89,28.32 38.35,20.95 35.18,20.32 32.39,21.46 30.23,25.15 19.68,9.53 19.68,12.06 23.49,17.14 9.53,17.14 0.64,15.88 1.91,14.61 8.89,3.17 8.89,5.71 8.26,29.84 8.26,27.3 10.79,28.57 6.99,24.76 0.64,20.95 3.17,20.95 14.61,20.95 17.14,20.95 19.68,23.49 5.71,23.49 31.11,14.61 27.3,8.26
  pour Bottom (isolate 0.127, no thermals): -3.17,36.2 56.52,36.2 56.52,-1.91 -3.17,-1.91
  pour Top (no thermals): 20.95,31.11 57.79,31.11 57.79,-0.64 20.95,-0.64
  pour Top (rank 3, no thermals): 20.32,-0.64 20.32,17.14 20.95,17.14 20.95,31.11 -1.91,31.11 -1.91,-0.64
ENC-A
  Top 0.152: U$11.P29 40.52,8.51 40.27,8.26 35.94,8.26 35.43,7.74 ENC.P$3
ENC-B
  Top 0.152: U$11.P30 41.02,8.51 40.9,8.39 40.34,7.82 37.57,7.82 36.65,7.82 36.43,7.6 ENC.P$4
HIGH_SIDE
  Top 0.152: I_SEN.4 20.05,28.01 RI-1.P$2
  Top 3.302: FET-1H.4 9.37,23.67 RI-2.P$2 RI-1.P$2 23.33,23.99 FET-2H.4
I_OUT  (via drill 0.35)
  Top 0.152: I_SEN.1 25.53,29.71 25.53,26.21 27.35,24.39 29.97,24.39 31.11,23.24 v31.11,21.84 | v35.43,13.34 35.68,13.09 U$11.P19
  Bottom 0.152: v31.11,21.84 35.43,17.53 v35.43,13.34
IN1  (via drill 0.35)
  Top 0.152: U$11.P16 36.24,14.59 36.17,14.65 33.83,14.65 30.86,11.68 v30.86,10.79
  Bottom 0.254: R2.1 16.89,12.32 18.41,10.79 v30.86,10.79
IN2  (via drill 0.35)
  Top 0.152: v34.16,14.1 37.01,14.1 U$11.P17
  Bottom 0.152: R4.1 33.95,14.1 v34.16,14.1
LED-B
  Top 0.152: U$11.P4 42.52,18.39 42.85,18.72 48.77,18.72 49.07,18.41 R7.2
LED-R
  Top 0.152: U$11.P3 43.02,18.16 43.28,18.41 47.62,18.41 48.64,18.41 50.08,16.98 R8.2
LMT-C  (via drill 0.35)
  Top 0.254: U$11.P11 39.1,17.51 39.1,16.87 41.36,14.61 v43.94,14.61
  Bottom 0.254: v43.94,14.61 52.71,14.61 LMT-C.3
N$1  (via drill 0.35)
  Top 0.508: v4.19,19.05 3.82,18.67 FET-1H.3
  Top 0.813: OUT1.1 2.54,3.17 D6.C
  Top 3.302: FET-1H.3 4.99,15.88 6.99,15.88 9.37,13.5 FET-1L.4 9.53,10.63 9.53,9.53 5.71,5.71 OUT1.1
  Bottom 0.508: v4.19,19.05 DRV-1.P7 6.35,19.05 7.31,20 C1.2
N$2
  Bottom 0.508: C1.1 9.21,20.89 9.78,20.32 DRV-1.P1 D1.C
N$3  (via drill 0.35)
  Top 0.508: v4.45,23.24 FET-1H.1
  Bottom 0.508: DRV-1.P8 5.5,22.19 v4.45,23.24
N$4  (via drill 0.35)
  Top 0.508: FET-1L.1 v4.44,13.08 v4.45,13.08
  Bottom 0.508: v4.45,13.08 5.5,14.13 DRV-1.P5
N$5  (via drill 0.35)
  Top 0.508: v18.16,19.05 16.53,19.05 FET-2H.3
  Top 0.813: OUT2.1 16.5,3.17 D7.C
  Top 3.302: FET-2H.3 18.95,15.88 20.95,15.88 23.33,13.5 FET-2L.4 23.49,10.63 23.49,9.53 19.68,5.71 OUT2.1
  Bottom 0.508: v18.16,19.05 DRV-2.P7 20.32,19.05 21.27,20 C2.2
N$6
  Bottom 0.508: C2.1 23.17,21.27 24.13,20.32 DRV-2.P1 D2.C
N$7
  Bottom 0.508: DRV-2.P2 31.24,19.05 31.75,18.54 R4.2
N$8  (via drill 0.35)
  Top 0.508: v18.41,23.24 FET-2H.1
  Bottom 0.508: DRV-2.P8 19.46,22.19 v18.41,23.24
N$9  (via drill 0.35)
  Top 0.508: FET-2L.1 v18.41,13.08
  Bottom 0.508: v18.41,13.08 19.46,14.13 DRV-2.P5
N$10
  Bottom 0.508: DRV-2.P3 29.21,17.78 29.84,17.14 R3.2 R9.1
N$11
  Bottom 0.508: DRV-1.P2 16.38,19.05 16.89,18.54 R2.2
N$12
  Bottom 0.508: DRV-1.P3 15.24,17.78 15.88,17.14 R1.2 R10.1
N$13
  Top 0.813: FLT1.P$3 29.93,27.3 34.16,27.3 | 34.16,27.3 PWR-SW.P$5 | 34.16,27.3 PWR-SW.P$2
N$14
  Top 0.254: U$4.P$2 51.05,12.95 SBUS.3
N$15
  Bottom 0.254: SB-SBUS.TO 49.21,10.79 SBUS.2
N$17
  Top 0.152: R8.1 LED-R.A
N$18  (via drill 0.35)
  Top 0.813: PWR-SW.P$6 PWR-SW.P$3 36.8,25.02 v38.86,25.02
  Bottom 0.813: v38.86,25.02 39.43,24.45 C13.1 39.69,23.49 41.27,23.49 | 41.27,23.49 D4.C | REG.1 41.54,23.75 41.27,23.49
N$19
  Top 0.254: OSC.P$1 42.98,19.49 42.02,18.53 U$11.P5
N$20
  Top 0.254: OSC.P$2 40.58,19.49 41.52,18.55 U$11.P6
N$23
  Top 0.152: R6.1 LED-G.A
N$24
  Top 0.152: R7.1 LED-B.A
OUT_EN  (via drill 0.35)
  Top 0.152: U$11.P15 33.75,15.09 30.73,12.06 v29.84,12.06
  Top 0.254: v29.84,12.06 28.57,12.06 27.3,10.79 v27.3,10.14
  Bottom 0.254: R1.1 15.88,12.45 17.93,10.39 27.3,10.39 v27.3,10.14 | R3.1 v29.84,12.06
RST-MCU
  Top 0.152: U$11.P7 41.02,18.16 40.77,18.41 40.01,19.18 40.01,20.32 38.1,22.22 U$1.P$2
SBUS2
  Top 0.254: U$4.P$4 47.49,13.59 U$11.P43
SWCLK  (via drill 0.3)
  Top 0.152: v43.82,10.79 44.02,10.59 U$11.P37
  Bottom 0.152: v43.82,10.79 45.09,9.53 SWD.2
SWDIO
  Top 0.152: U$11.P34 43.02,4.92 SWD.3
UART2-RX  (via drill 0.3)
  Top 0.254: v40.26,10.67 38.73,10.67 38.1,11.3 38.1,15.75 37.76,16.08 U$11.P13
  Bottom 0.254: UART2.3 41.5,2.95 41.5,9.43 v40.26,10.67
UART2-TX  (via drill 0.3)
  Top 0.254: v39.37,11.65 39.37,15.75 38.52,16.59 U$11.P12
  Bottom 0.254: UART2.4 41.09,2.99 41.09,8.44 39.37,10.16 v39.37,11.65
UART3-RX
  Top 0.152: U$11.P22 34.88,11.59 32.51,9.22 30.17,9.22 28.83,7.87 28.83,5.08 28.7,4.95 27.3,4.95 27.17,5.09 UART3.P$3
UART3-TX
  Top 0.152: UART3.P$4 28.17,7.72 29.97,9.53 32.39,9.53 34.95,12.09 U$11.P21

### Text on the board
tPlace: G | B | R